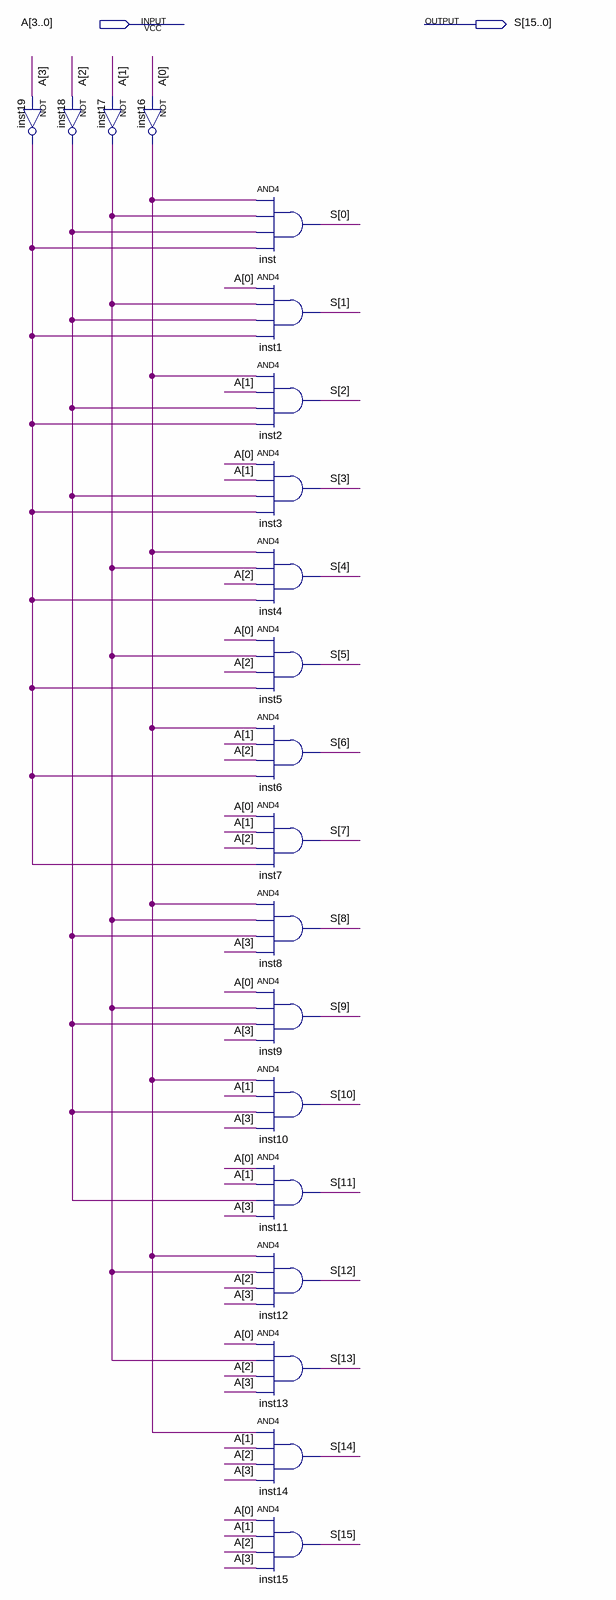
[diagram p0: schematic sheet]
// Quartus schematic DECODER4_16.bdf as structural Verilog: 20 symbols, 2 pins
module DECODER4_16 (
  input  [3:0] A,
  output [15:0] S
);

  wire inst16_out, inst17_out, inst18_out, inst19_out;

  not inst19 (inst19_out, A[3]);
  not inst17 (inst17_out, A[1]);
  not inst18 (inst18_out, A[2]);
  not inst16 (inst16_out, A[0]);
  and inst (S[0], inst16_out, inst17_out, inst18_out, inst19_out);
  and inst1 (S[1], A[0], inst17_out, inst18_out, inst19_out);
  and inst2 (S[2], inst16_out, A[1], inst18_out, inst19_out);
  and inst3 (S[3], A[0], A[1], inst18_out, inst19_out);
  and inst4 (S[4], inst16_out, inst17_out, A[2], inst19_out);
  and inst5 (S[5], A[0], inst17_out, A[2], inst19_out);
  and inst6 (S[6], inst16_out, A[1], A[2], inst19_out);
  and inst7 (S[7], A[0], A[1], A[2], inst19_out);
  and inst8 (S[8], inst16_out, inst17_out, inst18_out, A[3]);
  and inst9 (S[9], A[0], inst17_out, inst18_out, A[3]);
  and inst10 (S[10], inst16_out, A[1], inst18_out, A[3]);
  and inst11 (S[11], A[0], A[1], inst18_out, A[3]);
  and inst12 (S[12], inst16_out, inst17_out, A[2], A[3]);
  and inst13 (S[13], A[0], inst17_out, A[2], A[3]);
  and inst14 (S[14], inst16_out, A[1], A[2], A[3]);
  and inst15 (S[15], A[0], A[1], A[2], A[3]);
endmodule
